# EAGLE design bluetooth_header (EAGLE 7.4.0)
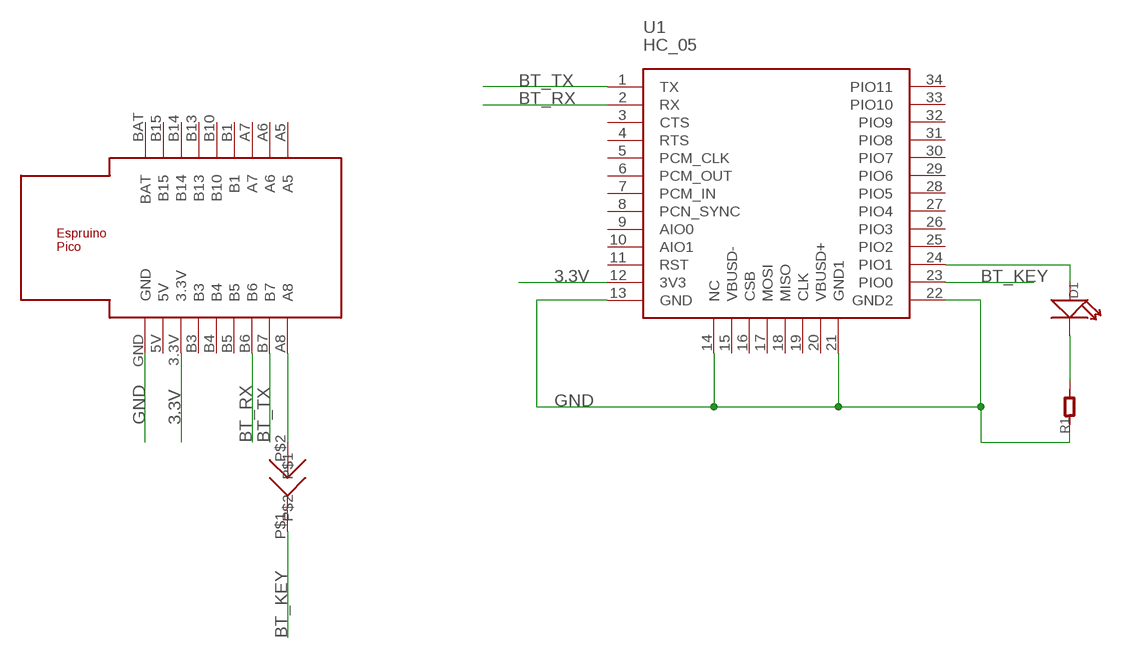
[diagram p0: schematic, sheet 1]

## Parts
D1  LED  [LED0603]
R1  R-0603  [R0603]
U1  HC_05  [BLUETOOTH_SMD]
U$1  ESPRUINO_PICO_0.1  [ESPRUINO_PICO_0.1]
U$2  SOLDERJUMPER  [SOLDERJUMPER]

## Nets
3.3V: U1.12(3V3) U$1.3.3V
BT_KEY: U1.23(PIO0) U$2.P$1
BT_RX: U1.2(RX) U$1.B6
BT_TX: U1.1(TX) U$1.B7
GND: R1.1 U1.13(GND) U1.14(NC) U1.21(GND1) U1.22(GND2) U$1.GND
N$6: D1.+ U1.24(PIO1)
N$7: D1.- R1.2
N$10: U$1.A8 U$2.P$2
Unconnected: U1.3(CTS) U1.4(RTS) U1.5(PCM_CLK) U1.6(PCM_OUT) U1.7(PCM_IN) U1.8(PCN_SYNC) U1.9(AIO0) U1.10(AIO1) U1.11(RST) U1.15(VBUSD-) U1.16(CSB) U1.17(MOSI) U1.18(MISO) U1.19(CLK) U1.20(VBUSD+) U1.25(PIO2) U1.26(PIO3) U1.27(PIO4) U1.28(PIO5) U1.29(PIO6) U1.30(PIO7) U1.31(PIO8) U1.32(PIO9) U1.33(PIO10) U1.34(PIO11) U$1.5V U$1.A5 U$1.A6 U$1.A7 U$1.B1 U$1.B3 U$1.B4 U$1.B5 U$1.B10 U$1.B13 U$1.B14 U$1.B15 U$1.BAT

## Library data of the parts
D1 = OPL Eagle Library:LED*: LED
R1 = OPL Eagle Library:R*
U1 = bluetooth:HC_05
U$1 = espruino_pico:ESPRUINO_PICO_0.1
U$2 = solder_jumper:SOLDERJUMPER

## Net classes
0 default: width 0.305 mm

## Board
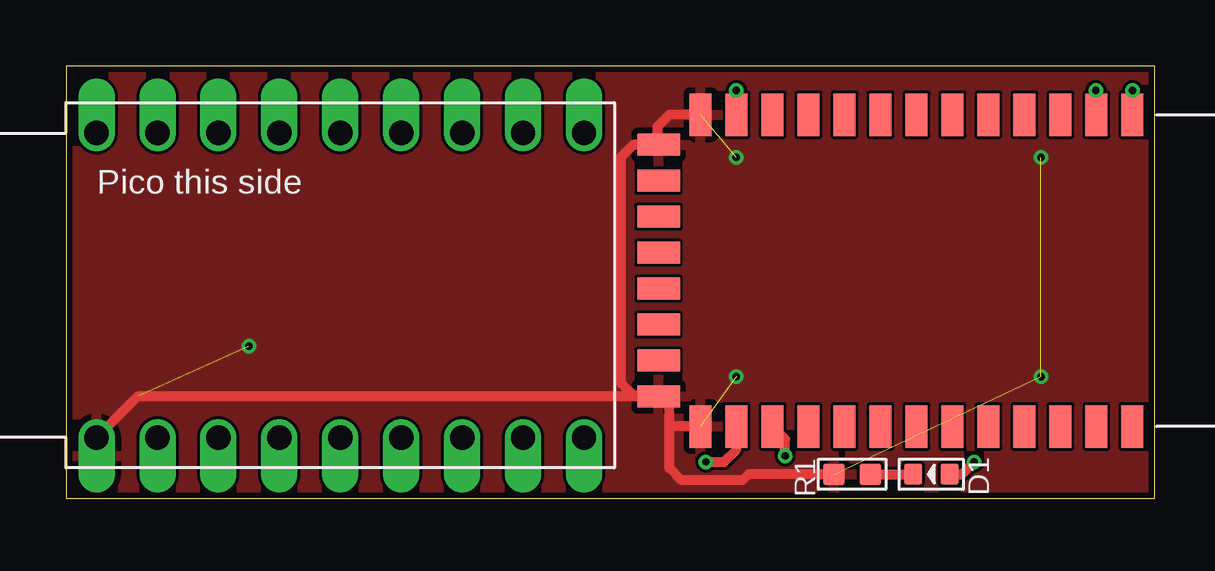
[diagram p1: board, top side]
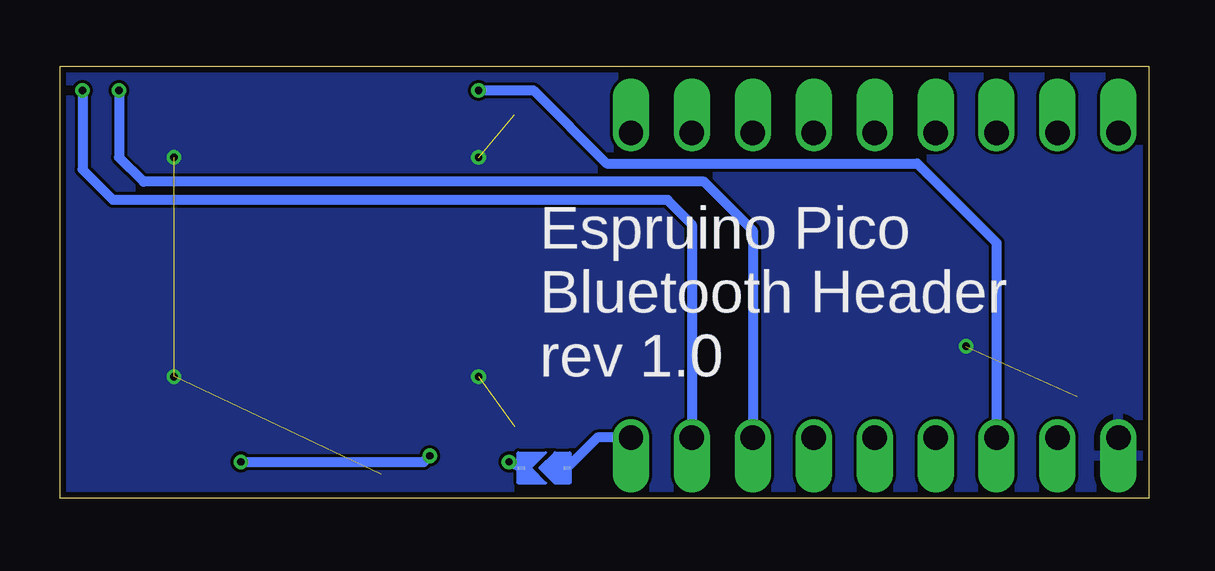
[diagram p2: board, bottom side, seen from below]

Size 45.39 x 18.02 mm. Coordinates in mm from the lower left corner, seen from the top.
Outline: 0,0 45.39,0 45.39,18.02 0,18.02 0,0
Copper layers (1*16): Top 0.035mm / dielectric 1.5mm / Bottom 0.035mm
Design rules "dirt_cheap_dirty_boards.v1": minimum track width 5mil, minimum drill 12mil, track to track 5mil, track to pad 5mil, pad to pad 5mil, via to via 5mil, smd to smd 0mil, copper to edge 10mil, drill to drill 10mil, minimum pad ring 10mil, minimum via ring 6mil, stop-mask expansion 2mil, vias tented up to drill 25mil, thermal gap 10mil

### Footprints (pad centres in the part's own frame; a part is rotated, then mirrored left to right if it is on the bottom)
LED0603 = smd 0.762 x 0.889: + -0.762,0; - 0.762,0
R0603 = smd 0.889 x 0.889: 1 -0.762,0; 2 0.762,0
BLUETOOTH_SMD = smd 1.778 x 0.914: 1 0,0; 2 0,-1.5; 3 0,-3; 4 0,-4.5; 5 0,-6; 6 0,-7.5; 7 0,-9; 8 0,-10.5; 9 0,-12; 10 0,-13.5; 11 0,-15; 12 0,-16.5; 13 0,-18; 22 13,-18; 23 13,-16.5; 24 13,-15; 25 13,-13.5; 26 13,-12; 27 13,-10.5; 28 13,-9; 29 13,-7.5; 30 13,-6; 31 13,-4.5; 32 13,-3; 33 13,-1.5; 34 13,0 | smd 0.914 x 1.778: 14 1.25,-19.75; 15 2.75,-19.75; 16 4.25,-19.75; 17 5.75,-19.75; 18 7.25,-19.75; 19 8.75,-19.75; 20 10.25,-19.75; 21 11.75,-19.75
ESPRUINO_PICO_0.1 = drill 1.016 offset: 3.3V -7.62,-6.35; 5V -10.16,-6.35; A5 7.62,6.35; A6 5.08,6.35; A7 2.54,6.35; A8 7.62,-6.35; B1 0,6.35; B3 -5.08,-6.35; B4 -2.54,-6.35; B5 0,-6.35; B6 2.54,-6.35; B7 5.08,-6.35; B10 -2.54,6.35; B13 -5.08,6.35; B14 -7.62,6.35; B15 -10.16,6.35; BAT -12.7,6.35; GND -12.7,-6.35
SOLDERJUMPER = smd 0.305 x 0.152: P$1 0.762,0; P$2 -1.143,0

### Placement (x,y rotation side)
D1  36.07,1.02 180 top
R1  32.77,1.02 0 top
U1  44.45,16 270 top
U$1  13.97,8.89 0 top
U$2  25.4,1.27 180 bottom

### Tracks (layer width: path | path; a pad name or v marks a point on that pad's centre or on a via)
3.3V  (via drill 0.3)
  Top 0.406: U1.12 27.95,16.01 v27.94,17.02
  Bottom 0.406: v27.94,17.02 25.65,17.02 22.61,13.97 9.65,13.97 6.35,10.67 U$1.3.3V
BT_KEY  (via drill 0.3)
  Top 0.406: v26.67,1.52 27.43,1.52 27.94,2.03 U1.23
  Bottom 0.406: U$2.P$1 v26.67,1.52
BT_RX  (via drill 0.3)
  Top 0.406: U1.2 42.95,15.47 v42.93,17.02
  Bottom 0.406: U$1.B6 16.51,11.18 18.54,13.21 41.91,13.21 42.93,14.22 v42.93,17.02
BT_TX  (via drill 0.3)
  Top 0.406: U1.1 v44.45,17.02
  Bottom 0.406: U$1.B7 19.05,11.43 20.07,12.45 43.18,12.45 44.45,13.72 v44.45,17.02
GND  (via drill 0.3)  (5 unrouted)
  Top 0.406: 25.15,3.05 25.15,1.27 25.65,0.76 28.19,0.76 28.45,1.02 R1.1 | 25.15,3.05 25.15,3.81 U1.21 | U1.22 25.19,3 25.15,3.05 | U1.13 25.15,16 24.64,15.49 24.64,14.81 U1.14 23.64,14.75 23.11,14.22 23.11,4.83 23.62,4.32 24.63,4.32 U1.21 | U1.21 2.98,4.25 U$1.GND
  other vias: 7.62,6.35 27.94,5.08 27.94,14.22 40.64,14.22 40.64,5.08
  pour Bottom: 0,18.03 45.47,18.03 45.47,0 0,0
  pour Top: 0,18.03 45.47,18.03 45.47,0 0,0
N$6  (via drill 0.3)
  Top 0.406: D1.+ 37.34,1.02 v37.85,1.52 | v29.97,1.78 29.97,2.48 U1.24
  Bottom 0.406: v37.85,1.52 30.23,1.52 v29.97,1.78
N$7
  Top 0.406: R1.2 D1.-
N$10
  Bottom 0.406: U$1.A8 22.99,2.54 U$2.P$2

### Text on the board
tNames: Pico this side
bNames: Espruino Pico / Bluetooth Header / rev 1.0